# EAGLE design ft231x-breakout-v11-openSX70version-5P-SEEED (EAGLE 8.6.3)
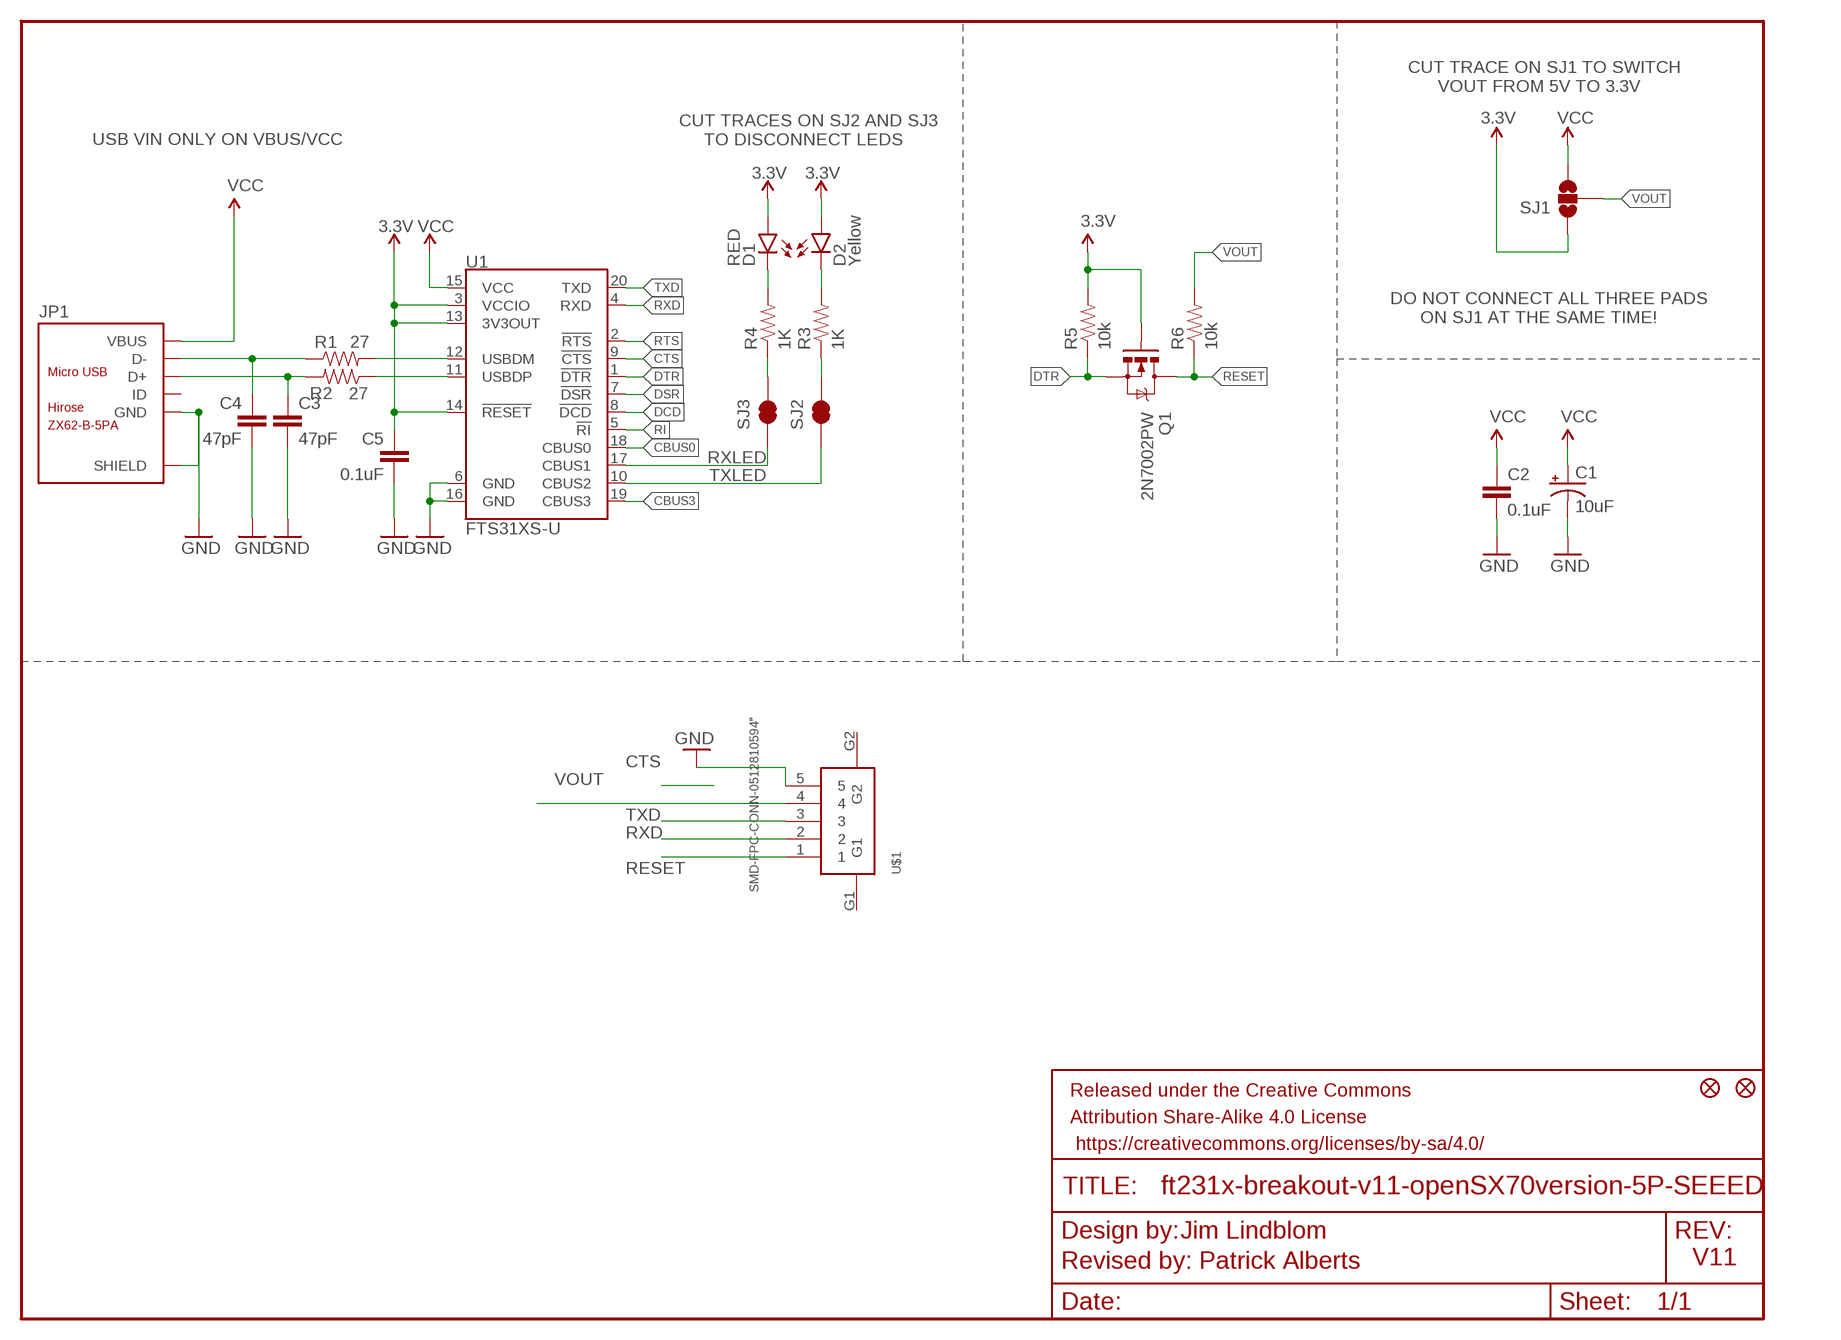
[diagram p0: schematic, sheet 1]

## Parts
C1  10uF  10UF-16V-10%(TANT)  [EIA3216]
C2  0.1uF  0.1UF-25V(+80/-20%)(0603)  [0603-CAP]
C3  47pF  47PF-50V-5%(0603)  [0603-CAP]
C4  47pF  47PF-50V-5%(0603)  [0603-CAP]
C5  0.1uF  0.1UF-25V(+80/-20%)(0603)  [0603-CAP]
D1  RED  LED-RED0603  [LED-0603]
D2  Yellow  LED-YELLOW0603  [LED-0603]
FRAME1  FRAME-LETTER  [CREATIVE_COMMONS]
JP1  ZX62-B-5PA  MICRO-USB-SMD(ZX62-B-5PA)  [MICRO-USB5+6P-SMD-0.65-AB]
JP5  FIDUCIAL1X2  [FIDUCIAL-1X2]
JP6  FIDUCIAL1X2  [FIDUCIAL-1X2]
Q1  2N7002PW  MOSFET-NCHANNEL2N7002PW  [SOT323]
R1  27  27OHM1/10W1%(0603)0603-RES  [0603-RES]
R2  27  27OHM1/10W1%(0603)0603-RES  [0603-RES]
R3  1K  1KOHM-1/10W-1%(0603)  [0603-RES]
R4  1K  1KOHM-1/10W-1%(0603)  [0603-RES]
R5  10k  10KOHM1/10W1%(0603)0603  [0603-RES@1]
R6  10k  10KOHM1/10W1%(0603)0603  [0603-RES@1]
SJ1  SOLDERJUMPER_2WAYS  [SJ_3]
SJ2  TXLED  SOLDERJUMPERTRACE  [SJ_2S-TRACE]
SJ3  RXLED  JUMPER-PAD-2-NC_BY_TRACE  [PAD-JUMPER-2-NC_BY_TRACE_YES_SILK]
U1  FTS31XS-U  FT231XS  [SSOP20_L]
U$1  SMD-FPC-CONN-0512810594"  [51281-0594]

## Nets
3.3V: C5.1 D1.A D2.A Q1.1(G) R5.2 SJ1.1 U1.3(VCCIO) U1.13(3V3OUT) U1.14(!RESET)
CBUS0: U1.18(CBUS0)
CBUS3: U1.19(CBUS3)
CTS: U1.9(!CTS)
DCD: U1.8(!DCD)
DSR: U1.7(!DSR)
DTR: Q1.2(S) R5.1 U1.1(!DTR)
GND: C1.C(-) C2.2 C3.2 C4.2 C5.2 JP1.5(GND) JP1.P1(SHIELD) JP1.P2(SHIELD) JP1.P3(SHIELD) JP1.P4(SHIELD) JP1.P5(SHIELD) JP1.P6(SHIELD) U1.6(GND) U1.16(GND) U$1.5
N$1: R1.2 U1.12(USBDM)
N$2: R2.1 U1.11(USBDP)
N$3: C3.1 JP1.3(D+) R2.2
N$4: C4.1 JP1.2(D-) R1.1
N$5: D2.C R3.2
N$6: D1.C R4.2
N$7: R3.1 SJ2.2
N$8: R4.1 SJ3.2
RESET: Q1.3(D) R6.1 U$1.1
RI: U1.5(!RI)
RTS: U1.2(!RTS)
RXD: U1.4(RXD) U$1.2
RXLED: SJ3.1 U1.17(CBUS1)
TXD: U1.20(TXD) U$1.3
TXLED: SJ2.1 U1.10(CBUS2)
VCC: C1.A(+) C2.1 JP1.1(VBUS) SJ1.3 U1.15(VCC)
VOUT: R6.2 SJ1.2 U$1.4
Unconnected: JP1.4(ID) U$1.G1 U$1.G2

## Notes on the sheet
- CUT TRACE ON SJ1 TO SWITCH
        VOUT FROM 5V TO 3.3V
- USB VIN ONLY ON VBUS/VCC
- CUT TRACES ON SJ2 AND SJ3 
       TO DISCONNECT LEDS
- DO NOT CONNECT ALL THREE PADS
        ON SJ1 AT THE SAME TIME!
- Jim Lindblom
- Revised by: Patrick Alberts | V11

## Library data of the parts
C1 = SparkFun-Capacitors:10UF-16V-10%(TANT): CAP-00811 1206/EIA-3216 Tantalum capacitor; PROD_ID: CAP-00811
C2 C5 = SparkFun-Capacitors:0.1UF-25V(+80/-20%)(0603): CAP-00810 Ceramic Standard decoupling cap; PROD_ID: CAP-00810
C3 C4 = SparkFun-Capacitors:47PF-50V-5%(0603): CAP-08913; PROD_ID: CAP-08913
D1 = SparkFun-LED:LED-RED: Assorted Red LEDs LilyPad 1206- DIO-09912 1206- DIO-00809 0603- DIO-00819 "SMART" means more efficient and expensive; PROD_ID: DIO-00819
D2 = SparkFun-LED:LED-YELLOW: Yellow SMD LEDs LilyPad 1206- DIO-09909 0603- DIO-09003 "SMART" means more efficient and expensive; PROD_ID: DIO-09003
FRAME1 = SparkFun-Aesthetics:FRAME-LETTER: Schematic Frame Standard 8.5x11 US Letter frame
JP1 = Seeed-Connector:MICRO-USB-SMD(ZX62-B-5PA): 320010005; MPN: ZX62-B-5PA
JP5 JP6 = SparkFun-Aesthetics:FIDUCIAL: Fiducial Alignment Points Various fiducial points for machine vision alignment.
Q1 = SparkFun-DiscreteSemi:MOSFET-NCHANNEL: Common NMOSFET Parts MFG P/N Store ID Prod ID FDD8780 TRANS-09984 SI7820DN TRANS-11055 FDS6630A IC-08089 2N7002PW TRANS-11151 FQP30N06L COM-10213 TRANS-10060 BSS123LT1G TRANS-08345 BSS138 TRANS-00830 BS170 2N7000; PROD_ID: TRANS-11151
R1 R2 = SparkFun-Resistors:27OHM1/10W1%(0603): RES-09334; PROD_ID: RES-09334
R3 R4 = SparkFun-Resistors:1KOHM-1/10W-1%(0603): RES-07856; PROD_ID: RES-07856
R5 R6 = SparkFun-Resistors:10KOHM1/10W1%(0603): RES-00824; PROD_ID: RES-00824; VALUE: 10K
SJ1 = SparkFun-Passives:SOLDERJUMPER_2WAY: Solder Jumper 2 way solder jumper
SJ2 = SparkFun-Passives:SOLDERJUMPER: Solder Jumper Standard SMD solder jumper. Used to automate production. Two varients : Normally Open and Normally Closed are the same, but have different paste layers. NC will have a large amount of paste and should jumper during reflow.
SJ3 = SparkFun-Passives:JUMPER-PAD-2-NC_BY_TRACE
U1 = SparkFun-DigitalIC:FT231X: FTDI FT231X Full Speed USB to Full-handshake UART This USB2.0 Full Speed IC offers a compact bridge to full handshake UART interfaces. The device is a UART, capable of operating up to 3MBaud, with low power consumption (8mA). The FT231X includes the complete FT-X series feature set and enables USB to be added into a system design quickly and easily over a UART interface.; PROD_ID: IC-11524
U$1 = Seeed-OPL-2017-01-connector-edward:SMD-FPC-CONN-0512810594: 320060184

## Board
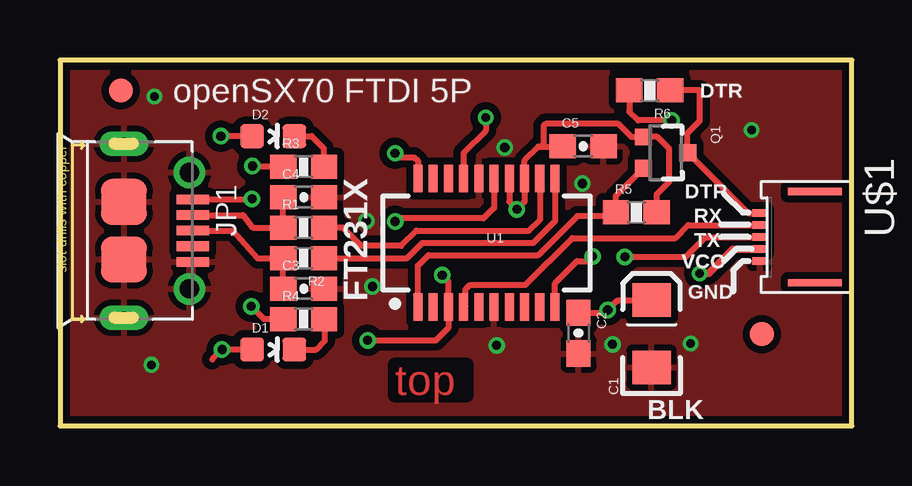
[diagram p1: board, top side]
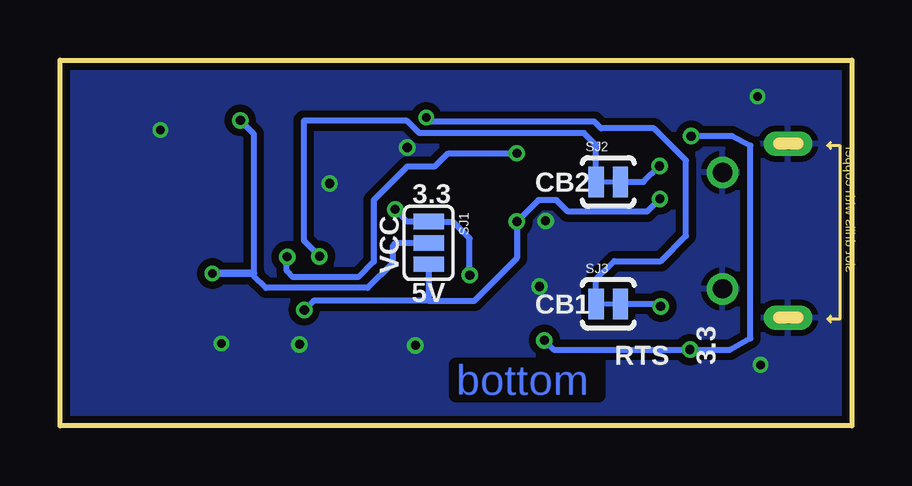
[diagram p2: board, bottom side, seen from below]

Size 33.02 x 15.24 mm. Coordinates in mm from the lower left corner, seen from the top.
Outline: 0,15.24 0,0 33.02,0 33.02,15.24 0,15.24
Copper layers (1*16): Top 0.035mm / dielectric 1.5mm / Bottom 0.035mm
Design rules "SeeedStudio_2layer_DRU_no_angle_20140221": minimum track width 6mil, minimum drill 12mil, track to track 6mil, track to pad 6mil, pad to pad 6mil, via to via 6mil, smd to smd 0mil, copper to edge 10mil, drill to drill 10mil, minimum pad ring 10mil, minimum via ring 6mil, stop-mask expansion 2mil, vias tented up to drill 100mil, thermal gap 10mil

### Footprints (pad centres in the part's own frame; a part is rotated, then mirrored left to right if it is on the bottom)
EIA3216 = smd 1.4 x 1.6: A 1.4,0; C -1.4,0
0603-CAP = smd 1.1 x 1: 1 -0.85,0; 2 0.85,0
LED-0603 = smd 1 x 1: A 0,-0.877; C 0,0.877
MICRO-USB5+6P-SMD-0.65-AB = smd 0.4 x 1.35: 1 -1.3,2.875; 2 -0.65,2.875; 3 0,2.875; 4 0.65,2.875; 5 1.3,2.875 | smd 1.9 x 1.9: P1 -1.2,0; P2 1.2,0 | drill 0.508 pad 1.016 long: P3 -3.625,0; P4 3.625,0 | drill 0.8: P5 -2.425,2.73; P6 2.425,2.73
FIDUCIAL-1X2 = smd 1 x 1: 1 0,0
SOT323 = smd 0.7 x 0.7: 1 -0.65,-0.925; 2 0.65,-0.925; 3 0,0.925
0603-RES = smd 1.1 x 1: 1 -0.85,0; 2 0.85,0
0603-RES@1 = smd 1.1 x 1: 1 -0.85,0; 2 0.85,0
SJ_3 = smd 0.635 x 1.27: 1 -0.889,0; 2 0,0; 3 0.889,0
SJ_2S-TRACE = smd 0.635 x 1.27: 1 -0.508,0; 2 0.508,0
PAD-JUMPER-2-NC_BY_TRACE_YES_SILK = smd 0.635 x 1.27: 1 -0.508,0; 2 0.508,0
SSOP20_L = smd 0.381 x 1.143: 1 -2.857,-2.68; 2 -2.223,-2.68; 3 -1.587,-2.68; 4 -0.953,-2.68; 5 -0.318,-2.68; 6 0.318,-2.68; 7 0.953,-2.68; 8 1.587,-2.68; 9 2.223,-2.68; 10 2.857,-2.68; 11 2.857,2.68; 12 2.223,2.68; 13 1.587,2.68; 14 0.953,2.68; 15 0.318,2.68; 16 -0.318,2.68; 17 -0.953,2.68; 18 -1.587,2.68; 19 -2.223,2.68; 20 -2.857,2.68
51281-0594 = smd 0.305 x 0.61: 1 1.3,-3.85; 2 1.8,-3.85; 3 2.3,-3.85; 4 2.8,-3.85; 5 3.3,-3.85 | smd 0.3 x 2.25: G1 0.4,-1.55; G2 4.2,-1.55

### Placement (x,y rotation side)
C1  24.66,3.84 90 top
C2  21.62,3.86 270 top
C3  10.16,5.71 0 top
C4  10.16,9.53 0 top
C5  21.81,11.65 0 top
D1  8.89,3.17 270 top
D2  8.89,12.06 270 top
FRAME1  -8.89,-11.43 0 top  (outside the outline)
JP1  2.67,8.13 270 top
JP5  29.26,3.82 0 top
JP6  2.54,13.97 0 top
Q1  25.25,11.38 270 top
R1  10.16,8.26 0 top
R2  10.16,6.99 180 top
R3  10.16,10.79 0 top
R4  10.16,4.45 0 top
R5  24.03,8.89 0 top
R6  24.59,13.97 180 top
SJ1  17.65,7.62 270 bottom
SJ2  10.16,10.16 0 bottom
SJ3  10.16,5.08 0 bottom
U1  17.78,7.62 0 top
U$1  33.02,10.16 270 top

### Tracks (layer width: path | path; a pad name or v marks a point on that pad's centre or on a via)
3.3V  (via drill 0.38)
  Top 0.254: U1.14 18.73,9.34 v19.05,9.02 19.37,9.34 U1.13 19.37,11.06 19.94,11.63 20.05,11.63 | v12.83,3.56 15.67,3.56 16.19,4.08 U1.3 16.19,6.02 v15.94,6.27 | D2.A v6.71,12.06 | D1.A v6.76,3.17 6.35,2.77 | R5.2 24.88,9.64 25.4,10.16 25.4,11.54 24.91,12.03 Q1.1 23.84,12.03 23.48,12.39 | C5.1 20.95,11.63 20.05,11.63 | 23.48,12.39 | 23.48,12.39 23.29,12.58 20.25,12.58 20.16,12.5 20.16,11.75 20.05,11.63
  Bottom 0.254: v19.05,9.02 18.54,8.51 SJ1.1 16.64,8.51 15.94,7.81 v15.94,6.27 | v12.83,3.56 12.45,3.17 v6.76,3.17 5.08,3.17 4.23,3.64 4.23,11.67 5.01,12.06 v6.71,12.06
DTR
  Top 0.254: U1.1 14.92,6.67 15.37,7.11 19.94,7.11 21.57,8.74 22.71,8.74 22.86,8.89 R5.1 23.18,9.59 Q1.2
GND  (via drill 0.35, 0.38)
  other vias: 18.54,11.6 18.2,3.35 13.03,5.8 21.78,10.1 23.04,3.39 12.77,8.54 26.29,3.43 28.83,12.32 3.81,2.54 3.94,13.72
  pour Top (isolate 0.305): 0,15.24 0,0 33.02,0 33.02,15.24
  pour Bottom (isolate 0.305): 0,15.24 0,0 33.02,0 33.02,15.24
N$1
  Top 0.254: U1.12 20,8.57 19.56,8.13 14.86,8.13 14.22,7.49 12.56,7.49 11.8,8.26 R1.2 | R1.2 11.18,8.26 | 11.04,8.23 R1.2
N$2
  Top 0.254: U1.11 20.64,8.52 19.74,7.62 15.11,7.62 14.48,6.99 R2.1
N$3
  Top 0.254: C3.1 R2.2 9.3,6.98 8.24,6.98 7.22,8.13 JP1.3
N$4
  Top 0.254: C4.1 R1.1 8.03,8.26 7.63,8.78 JP1.2
N$5
  Top 0.254: D2.C 10.49,12.06 11,11.56 11,10.81 R3.2
N$6
  Top 0.254: 10.91,4.34 R4.2 11.05,4.41 11.05,3.56 10.67,3.17 D1.C
N$7  (via drill 0.38)
  Top 0.254: v8.03,10.82 9.29,10.82 R3.1
  Bottom 0.254: SJ2.2 8.69,10.16 v8.03,10.82
N$8  (via drill 0.38)
  Top 0.254: R4.1 8.51,4.45 v7.98,4.98
  Bottom 0.254: SJ3.2 8.08,5.08 v7.98,4.98
RESET
  Top 0.254: R6.1 26.67,13.97 26.67,12.7 26.16,12.19 Q1.3 28.69,8.86 U$1.1 29.14,8.89
RXD
  Top 0.178: 16.92,4.98 U1.4
  Top 0.254: 27.94,8.36 26.19,8.36 25.65,7.82 21.36,7.82 19.41,5.87 17.09,5.87 16.92,5.69 16.92,4.98 | 27.94,8.36 28.47,8.36 | 27.94,8.36 U$1.2
RXLED  (via drill 0.35)
  Top 0.254: v17.75,12.85 17.75,12.29 16.83,11.37 U1.17
  Bottom 0.254: SJ3.1 10.67,6.1 9.91,6.86 7.97,6.86 6.92,7.91 6.92,11.06 8.26,12.39 10.46,12.39 10.74,12.68 17.75,12.68 v17.75,12.85
TXD  (via drill 0.38)
  Top 0.254: v23.55,7.04 26.09,7.04 26.67,7.62 26.91,7.86 | U1.20 14.92,11.03 14.77,11.19 14.14,11.19 v13.97,11.35 13.97,11.43 | 26.91,7.86 26.92,7.87 26.93,7.87 | 26.91,7.86 U$1.3
  Bottom 0.254: v23.55,7.04 23.57,7.01 23.57,6.45 23.32,6.2 20.57,6.2 19.94,6.83 19.94,9.4 18.54,10.79 17.4,10.79 16.84,11.35 v13.97,11.35
TXLED  (via drill 0.38)
  Top 0.254: U1.10 20.64,5.93 21.56,6.86 21.99,6.86 v22.2,7.06
  Bottom 0.254: SJ2.1 10.67,11.68 11.18,12.19 18.03,12.19 18.54,12.7 22.86,12.7 22.86,7.72 v22.2,7.06
VCC  (via drill 0.38)
  Top 0.254: U1.15 18.1,9.08 17.65,8.64 14.1,8.64 v13.97,8.51 | C1.A 24.63,5.21 23.22,5.21 v22.84,4.83 22.72,4.71 C2.1 | JP1.1 7.98,9.43 v8.01,9.45
  Bottom 0.254: 17.65,5.21 15.75,5.21 13.97,6.99 v13.97,8.51 13.08,9.4 12.32,9.4 11.84,8.92 8.54,8.92 v8.01,9.45 | SJ1.3 17.65,5.21 | 17.65,5.21 22.45,5.21 v22.84,4.83
VOUT  (via drill 0.35, 0.38)
  Top 0.254: R6.2 23.74,13.09 24.11,12.72 v25.5,12.72
  Top 0.305: U$1.4 28.06,7.36 27.05,6.35 v26.67,6.35
  Bottom 0.254: SJ1.2 19.02,7.62 19.14,7.5 19.14,6.79 20.19,5.74 24.43,5.74 24.94,6.25 24.94,6.35 24.94,12.17 v25.5,12.72
  Bottom 0.305: v26.67,6.35 24.94,6.35

### Text on the board
Top: top
Bottom: bottom
tPlace: DTR | openSX70 FTDI 5P | DTR | RX | FT231X | TX | VCC | VCC | GND | BLK
bPlace: CB2 | 3.3 | 5V | VCC | CB1 | 3.3 | RTS
tDocu: J. Lindblom | Revised by: Patrick Alberts